# EAGLE schematic main_backup (EAGLE 9.6.2)
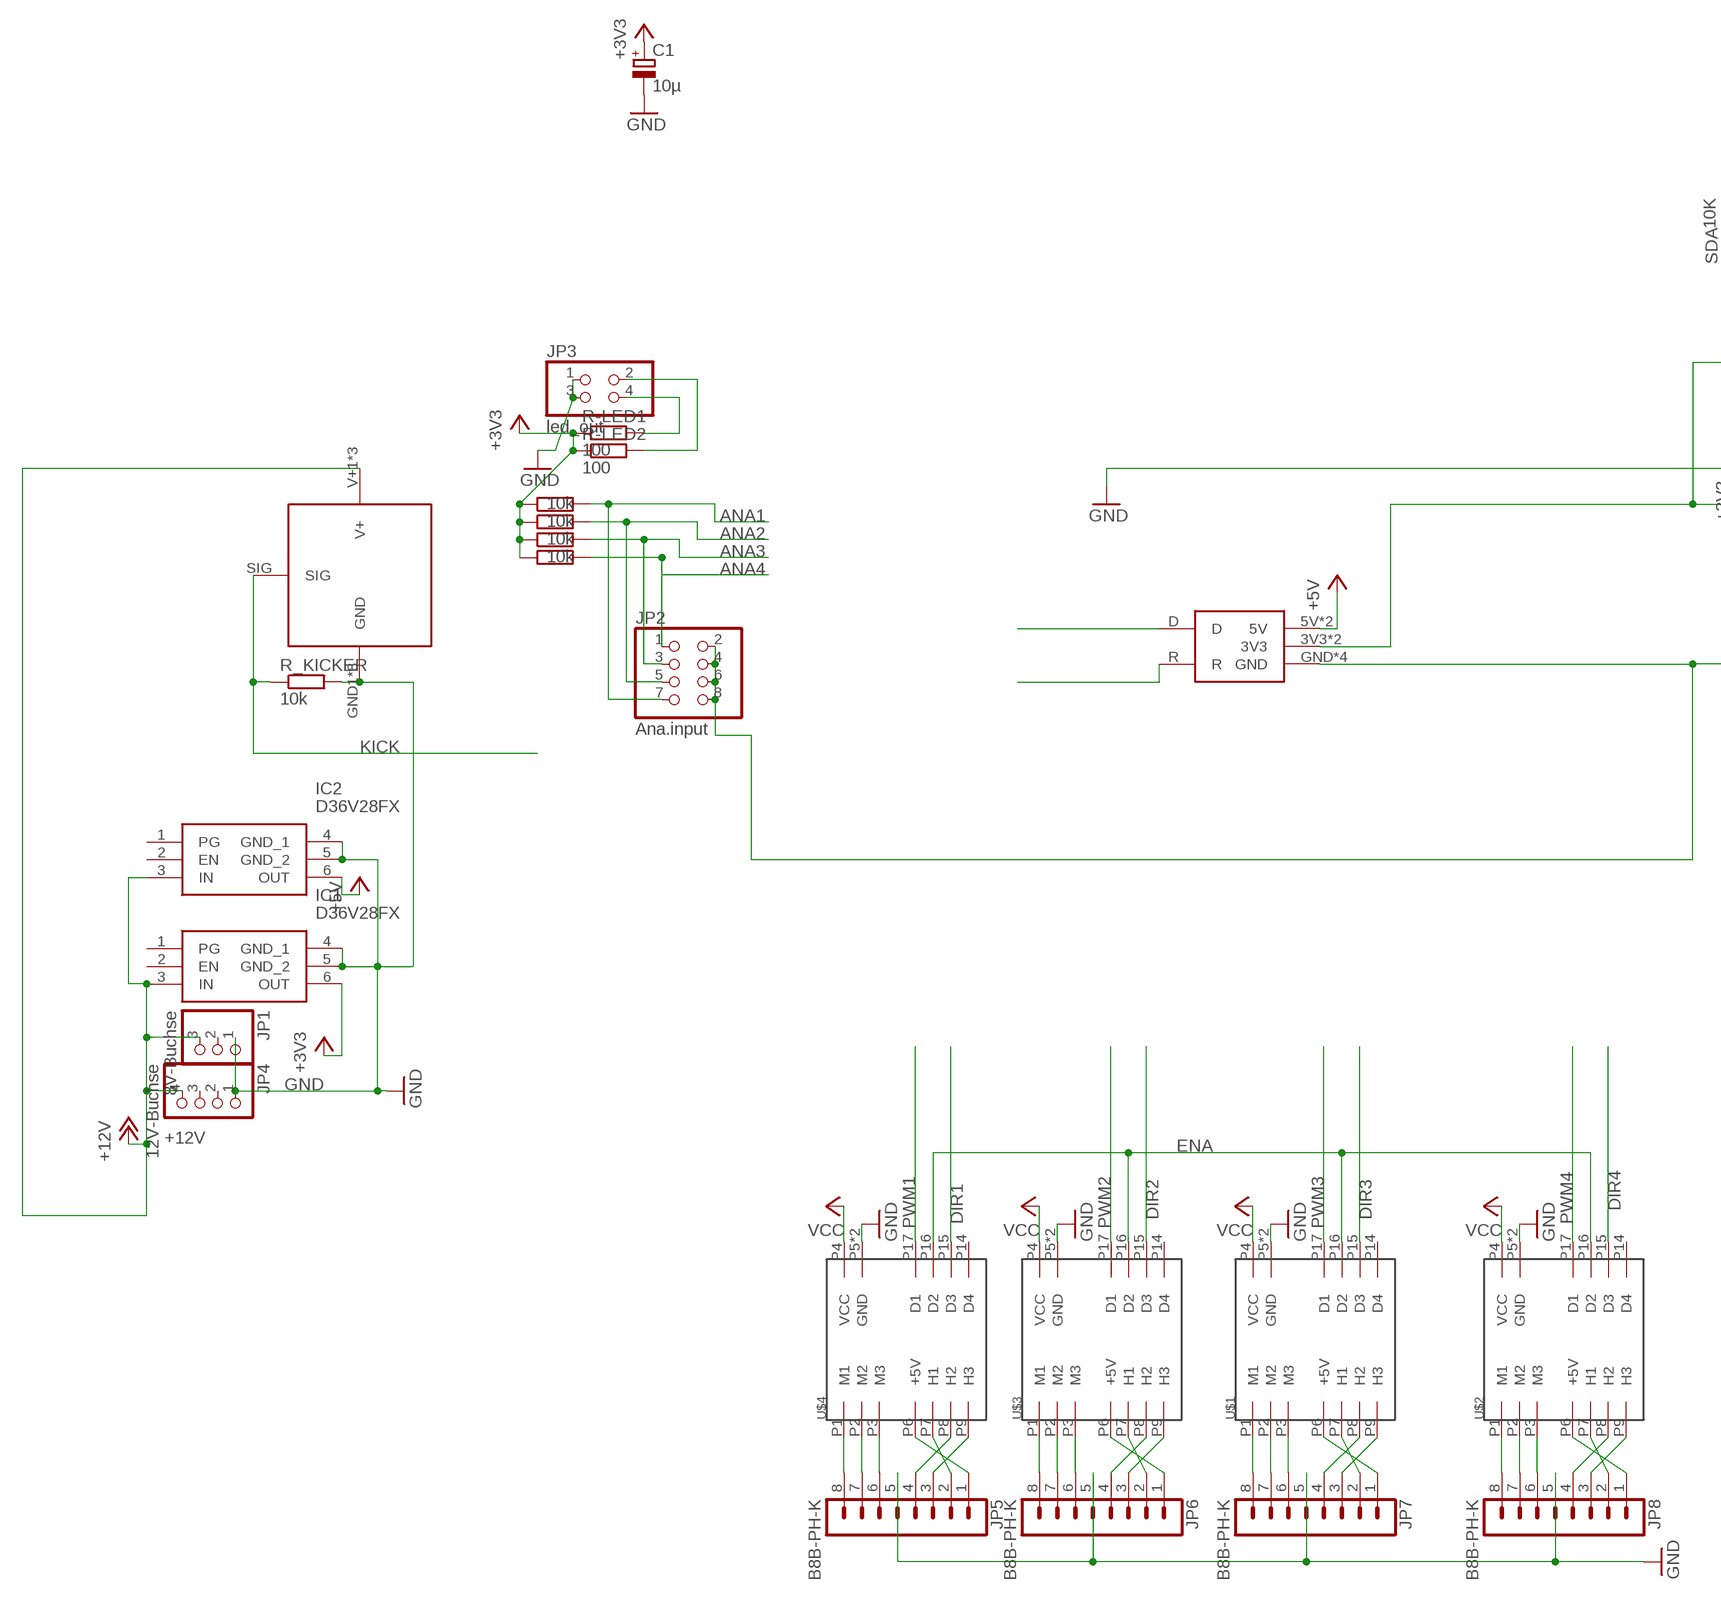
[diagram p0: schematic, sheet 1, part 1 of 2]
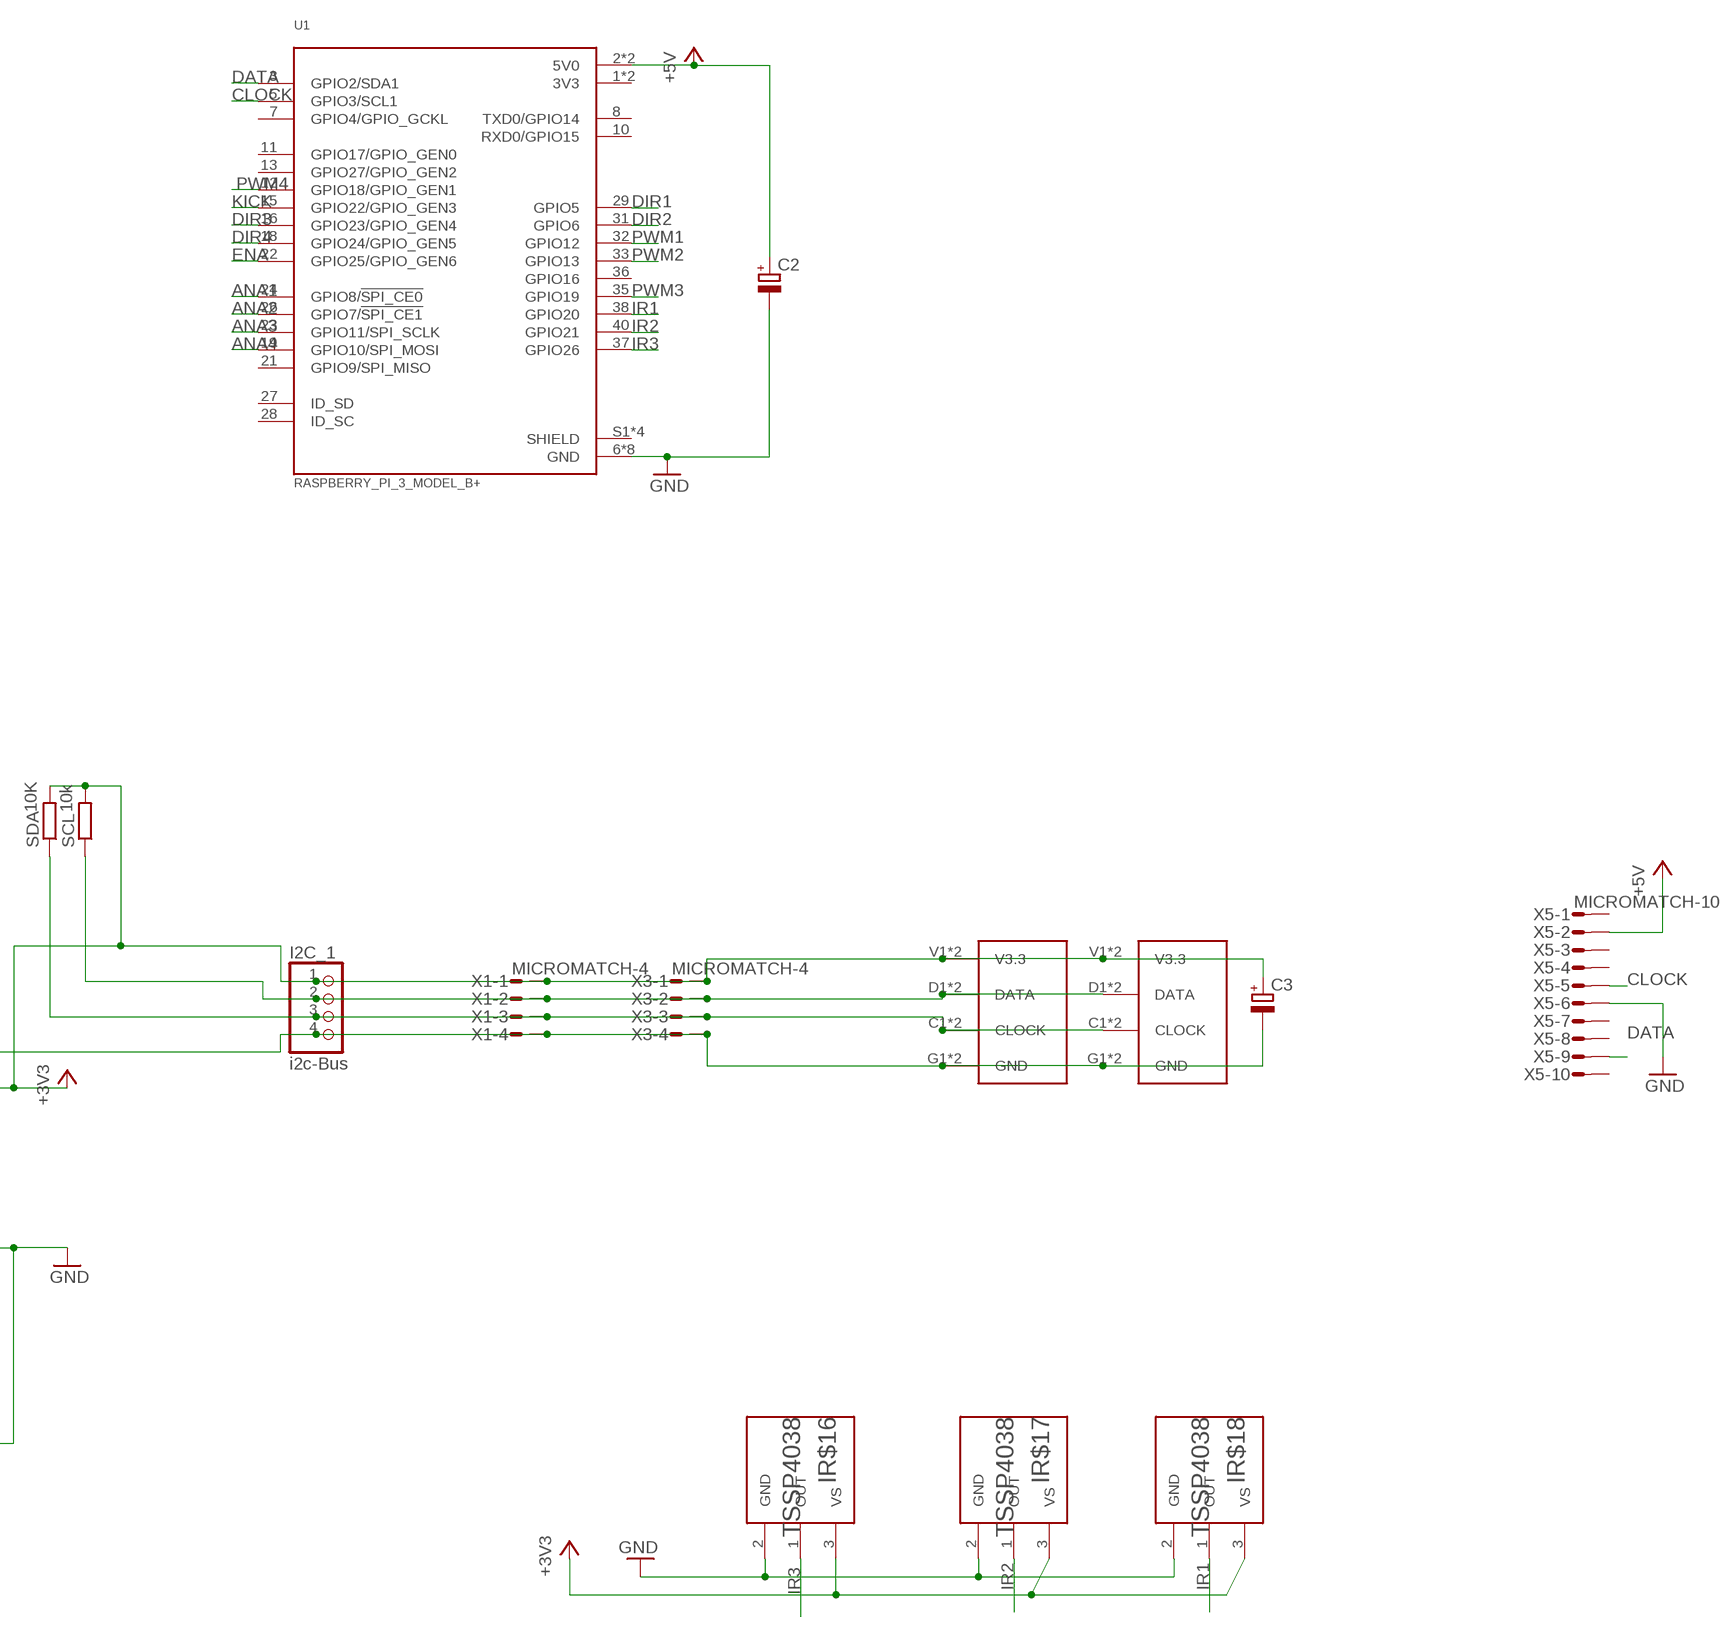
[diagram p1: schematic, sheet 1, part 2 of 2]

## Parts
C1  10µ  CPOL-EUE2,5-6E  [E2,5-6E]
C2  CPOL-EUE2-5  [E2-5]
C3  CPOL-EUE2-5  [E2-5]
I2C_1  i2c-Bus  PINHD-1X4  [1X04]
IC1  D36V28FX  [D36V28FX]
IC2  D36V28FX  [D36V28FX]
IR$16  TSSP4038  [XDCR_TSSP4038]
IR$17  TSSP4038  [XDCR_TSSP4038]
IR$18  TSSP4038  [XDCR_TSSP4038]
JP1  8V-Buchse  PINHD-1X3  [1X03]
JP2  Ana.input  PINHD-2X4  [2X04]
JP3  led_out  PINHD-2X2  [2X02]
JP4  12V-Buchse  PINHD-1X4  [1X04]
JP5  B8B-PH-K  [B8B-PH-K]
JP6  B8B-PH-K  [B8B-PH-K]
JP7  B8B-PH-K  [B8B-PH-K]
JP8  B8B-PH-K  [B8B-PH-K]
R-LED1  100  R-EU_0207/10  [0207/10]
R-LED2  100  R-EU_0207/10  [0207/10]
R_AD14  10k  R-EU_0207/10  [0207/10]
R_AD25  10k  R-EU_0207/10  [0207/10]
R_AD26  10k  R-EU_0207/10  [0207/10]
R_AD27  10k  R-EU_0207/10  [0207/10]
R_KICKER  10k  R-EU_0207/10  [0207/10]
SCL  10k  R-EU_0207/10  [0207/10]
SDA  10K  R-EU_0207/10  [0207/10]
U1  RASPBERRY_PI_3_MODEL_B+  [MODULE_RASPBERRY_PI_3_MODEL_B+]
U$1  24/2  [24/2]
U$2  24/2  [24/2]
U$3  24/2  [24/2]
U$4  24/2  [24/2]
U$5  CANBUS  [CANBUS]
U$8  TASTER_LED  [TASTER_LED]
U$9  TASTER_LED  [TASTER_LED]
U$17  KICKER  [KICKER]
X1  MICROMATCH-4  [MICROMATCH-4]
X3  MICROMATCH-4  [MICROMATCH-4]
X5  MICROMATCH-10  [MICROMATCH-10]

## Nets
+3V3: C1.+ C3.+ I2C_1.1 IC1.6(OUT) IR$16.3(VS) IR$17.3(VS) IR$18.3(VS) R-LED1.1 R-LED2.1 R_AD14.1 R_AD25.1 R_AD26.1 R_AD27.1 SCL.2 SDA.2 U$5.3V3 U$5.3V3_1(3V3) U$8.V1(V3.3) U$8.V2(V3.3) U$9.V1(V3.3) U$9.V2(V3.3) X1.1 X3.1
+5V: C2.+ IC2.6(OUT) U1.2(5V0) U1.4(5V0) U$5.5V U$5.5V_1(5V) X5.2
+12V: IC1.3(IN) IC2.3(IN) JP1.3 JP4.4 U$17.V+1(V+) U$17.V+2(V+) U$17.V+3(V+)
ANA1: JP2.7 R_AD25.2 U1.24(GPIO8/!SPI_CE0!)
ANA2: JP2.5 R_AD26.2 U1.26(GPIO7/!SPI_CE1!)
ANA3: JP2.3 R_AD27.2 U1.23(GPIO11/SPI_SCLK)
ANA4: JP2.1 R_AD14.2 U1.19(GPIO10/SPI_MOSI)
CLOCK: I2C_1.3 SDA.1 U1.5(GPIO3/SCL1) U$8.C1(CLOCK) U$8.C2(CLOCK) U$9.C1(CLOCK) U$9.C2(CLOCK) X1.3 X3.3 X5.5
D: U$5.D
DATA: I2C_1.2 SCL.1 U1.3(GPIO2/SDA1) U$8.D1(DATA) U$8.D2(DATA) U$9.D1(DATA) U$9.D2(DATA) X1.2 X3.2 X5.9
DIR1: U1.29(GPIO5) U$4.P15(D3)
DIR2: U1.31(GPIO6) U$3.P15(D3)
DIR3: U1.16(GPIO23/GPIO_GEN4) U$1.P15(D3)
DIR4: U1.18(GPIO24/GPIO_GEN5) U$2.P15(D3)
ENA: U1.22(GPIO25/GPIO_GEN6) U$1.P16(D2) U$2.P16(D2) U$3.P16(D2) U$4.P16(D2)
GND: C1.- C2.- C3.- I2C_1.4 IC1.4(GND_1) IC1.5(GND_2) IC2.4(GND_1) IC2.5(GND_2) IR$16.2(GND) IR$17.2(GND) IR$18.2(GND) JP1.1 JP2.2 JP2.4 JP2.6 JP2.8 JP3.1 JP3.3 JP4.1 JP5.5 JP6.5 JP7.5 JP8.5 R_KICKER.2 U1.6(GND) U1.9(GND) U1.14(GND) U1.20(GND) U1.25(GND) U1.30(GND) U1.34(GND) U1.39(GND) U$1.P5(GND) U$1.P18(GND) U$2.P5(GND) U$2.P18(GND) U$3.P5(GND) U$3.P18(GND) U$4.P5(GND) U$4.P18(GND) U$5.GND U$5.GND_1(GND) U$5.GND_2(GND) U$5.GND_3(GND) U$8.G1(GND) U$8.G2(GND) U$9.G1(GND) U$9.G2(GND) U$17.GND1(GND) U$17.GND2(GND) U$17.GND3(GND) U$17.GND4(GND) U$17.GND5(GND) U$17.GND6(GND) U$17.GND7(GND) U$17.GND8(GND) X1.4 X3.4 X5.6
IR1: IR$18.1(OUT) U1.38(GPIO20)
IR2: IR$17.1(OUT) U1.40(GPIO21)
IR3: IR$16.1(OUT) U1.37(GPIO26)
KICK: R_KICKER.1 U1.15(GPIO22/GPIO_GEN3) U$17.SIG
N$6: JP5.8 U$4.P1(M1)
N$7: JP5.7 U$4.P2(M2)
N$8: JP3.4 R-LED1.2
N$9: JP3.2 R-LED2.2
N$10: JP5.6 U$4.P3(M3)
N$11: JP6.8 U$3.P1(M1)
N$12: JP6.7 U$3.P2(M2)
N$13: JP6.6 U$3.P3(M3)
N$14: JP7.8 U$1.P1(M1)
N$15: JP7.7 U$1.P2(M2)
N$16: JP7.6 U$1.P3(M3)
N$17: JP8.8 U$2.P1(M1)
N$18: JP8.7 U$2.P2(M2)
N$19: JP8.6 U$2.P3(M3)
N$20: JP5.1 U$4.P6(+5V)
N$21: JP6.1 U$3.P6(+5V)
N$22: JP7.1 U$1.P6(+5V)
N$23: JP8.1 U$2.P6(+5V)
N$24: JP5.2 U$4.P7(H1)
N$25: JP5.3 U$4.P9(H3)
N$26: JP5.4 U$4.P8(H2)
N$27: JP6.2 U$3.P7(H1)
N$28: JP6.3 U$3.P9(H3)
N$29: JP6.4 U$3.P8(H2)
N$30: JP7.2 U$1.P7(H1)
N$31: JP7.3 U$1.P9(H3)
N$32: JP7.4 U$1.P8(H2)
N$33: JP8.2 U$2.P7(H1)
N$34: JP8.3 U$2.P9(H3)
N$35: JP8.4 U$2.P8(H2)
PWM1: U1.32(GPIO12) U$4.P17(D1)
PWM2: U1.33(GPIO13) U$3.P17(D1)
PWM3: U1.35(GPIO19) U$1.P17(D1)
PWM4: U1.12(GPIO18/GPIO_GEN1) U$2.P17(D1)
R: U$5.R
V+: U$1.P4(VCC) U$2.P4(VCC) U$3.P4(VCC) U$4.P4(VCC) ; supply symbol labelled VCC
Unconnected: IC1.1(PG) IC1.2(EN) IC2.1(PG) IC2.2(EN) JP1.2 JP4.2 JP4.3 U1.7(GPIO4/GPIO_GCKL) U1.8(TXD0/GPIO14) U1.10(RXD0/GPIO15) U1.11(GPIO17/GPIO_GEN0) U1.13(GPIO27/GPIO_GEN2) U1.21(GPIO9/SPI_MISO) U1.27(ID_SD) U1.28(ID_SC) U1.36(GPIO16) U$1.P14(D4) U$2.P14(D4) U$3.P14(D4) U$4.P14(D4) X5.1 X5.3 X5.4 X5.7 X5.8 X5.10

## Power pins joined to a net without a drawn wire
3V3: U1.1(3V3) U1.17(3V3)
SHIELD: U1.S1(SHIELD) U1.S2(SHIELD) U1.S3(SHIELD) U1.S4(SHIELD)

## Library data of the parts
C1-C3 = rcl:CPOL-EU: POLARIZED CAPACITOR, European symbol; SPICEPREFIX: C
I2C_1 JP4 = pinhead:PINHD-1X4: PIN HEADER
IC1 IC2 = D36V28FX:D36V28FX: 5V, 3.2A Step-Down Voltage Regulator D36V28F5 Source: Datasheet <https://www.pololu.com/product/3782>; DESCRIPTION: 5V, 3.2A Step-Down Voltage Regulator D36V28F5; HEIGHT: 8.77mm; MANUFACTURER_NAME: POLOLU ROBOTICS & ELECTRONICS; MANUFACTURER_PART_NUMBER: D36V28FX
IR$16-IR$18 = TSSP4038:TSSP4038: Check availability <https://pricing.snapeda.com/parts/TSSP4038/Vishay%20Semiconductor/view-part?ref=eda>; AVAILABILITY: In Stock; DESCRIPTION: Remote Receiver Sensor, 38.0kHz 1m PCB, Through Hole; MF: Vishay Semiconductor; MP: TSSP4038; PACKAGE: None; PRICE: None; PURCHASE-URL: https://pricing.snapeda.com/search/part/TSSP4038/?ref=eda
JP1 = pinhead:PINHD-1X3: PIN HEADER
JP2 = pinhead:PINHD-2X4: PIN HEADER
JP3 = pinhead:PINHD-2X2: PIN HEADER
JP5-JP8 = con-jst-ph:B8B-PH-K: HEADER
R-LED1 R-LED2 R_AD14 R_AD25-R_AD27 R_KICKER SCL SDA = rcl:R-EU_: RESISTOR, European symbol; SPICEPREFIX: R
U1 = RASPBERRY_PI_3_MODEL_B_:RASPBERRY_PI_3_MODEL_B+: BCM2835 Raspberry Pi Model B+ - ARM11, VideoCore MPU Embedded Evaluation Board Check availability <https://pricing.snapeda.com/parts/RASPBERRY%20PI%203%20MODEL%20B%2B/Raspberry%20Pi/view-part?ref=eda>; AVAILABILITY: In Stock; DESCRIPTION: RASPBERRY PI 3 MOD B+ BCM2837B0; MF: Raspberry Pi; MP: RASPBERRY PI 3 MODEL B+; PACKAGE: None; PRICE: None; PURCHASE-URL: https://pricing.snapeda.com/search/part/RASPBERRY PI 3 MODEL B+/?ref=eda
U$1-U$4 = maxon-Regler:24/2
U$5 = canbus:CANBUS
U$8 U$9 = Taster_LED:TASTER_LED: Taster / LED Board mit 2 Tastern und 2 LEDs Angeschlossen über i2c Port Expander PCF8574TS i2c Adresse zwingend per Lötbrücke zu setzen.
U$17 = kicker:KICKER
X1 X3 = con-amp-micromatch:MICROMATCH-4: MicroMaTch 4 7-215464-4 / 0-215464-4 Drawing Number C-215464 DDEController.pdf; MPN: 7-215464-4; OC_FARNELL: 3784629; OC_NEWARK: 19R8124
X5 = con-amp-micromatch:MICROMATCH-10: MicroMaTch 10 8-215464-0 / 1-215464-0 Drawing Number C-215464 DDEController.pdf; MF: FARNELL; MPN: 8-215464-0; OC_FARNELL: 3784654; OC_NEWARK: 19J6430